# Altium schematic sheet 05_MCU1.SchDoc
size A4
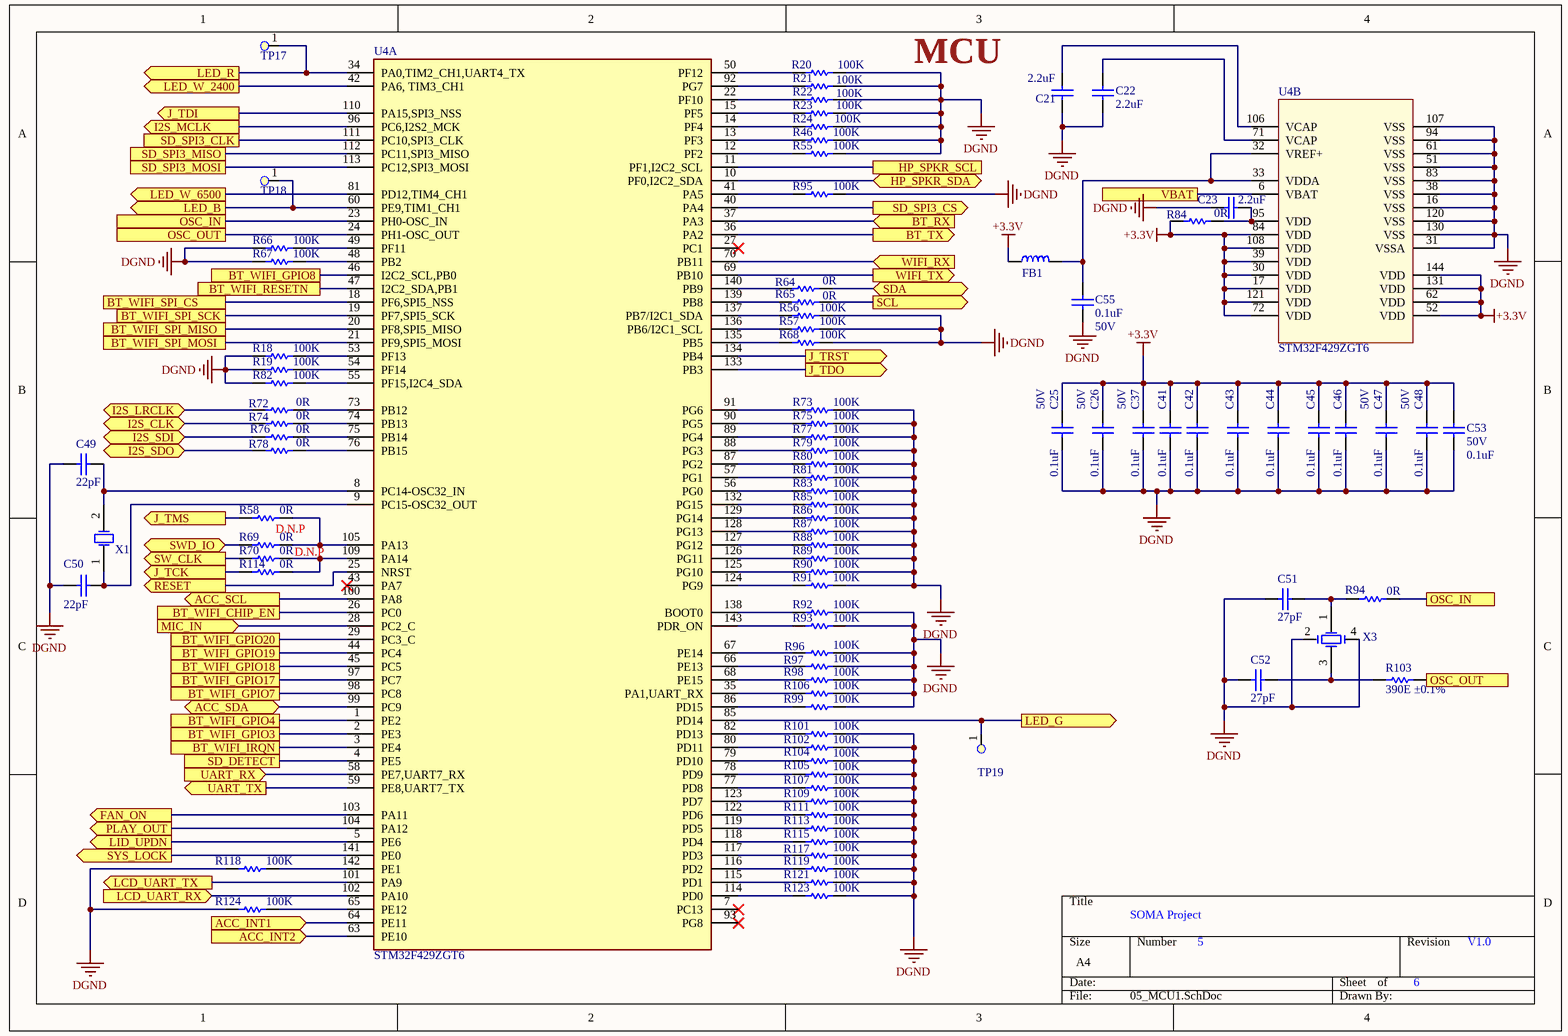
[diagram p0: 05_MCU1.SchDoc]

## Parts
C21  2.2uF  [C0402]
C22  2.2uF  [C0402]
C23  2.2uF  [C0402]
C25  Rating: 50V  [C0402]  (hidden comment: 0.1uF)
C26  Rating: 50V  [C0402]  (hidden comment: 0.1uF)
C37  Rating: 50V  [C0402]  (hidden comment: 0.1uF)
C41  0.1uF  [C0402]
C42  0.1uF  [C0402]
C43  0.1uF  [C0402]
C44  0.1uF  [C0402]
C45  0.1uF  [C0402]
C46  0.1uF  [C0402]
C47  Rating: 50V  [C0402]  (hidden comment: 0.1uF)
C48  Rating: 50V  [C0402]  (hidden comment: 0.1uF)
C49  22pF  [C0402]
C50  22pF  [C0402]
C51  27PF  [C0402]
C52  27PF  [C0402]
C53  Rating: 50V  [C0402]  (hidden comment: 0.1uF)
C55  Rating: 50V  [C0402]  (hidden comment: 0.1uF)
FB1  600 Ohms @ 100MHz  [FB0603]  (value not drawn)
R18  100K  [R0402]
R19  100K  [R0402]
R20  100K  [R0402]
R21  100K  [R0402]
R22  100K  [R0402]
R23  100K  [R0402]
R24  100K  [R0402]
R46  100K  [R0402]
R55  100K  [R0402]
R56  100K  [R0402]
R57  100K  [R0402]
R58  value 0R  [R0402]  (hidden comment: RES SMD 0 OHM JUMPER 1/16W 0402)
R64  value 0R  [R0402]  (hidden comment: RES SMD 0 OHM JUMPER 1/16W 0402)
R65  value 0R  [R0402]  (hidden comment: RES SMD 0 OHM JUMPER 1/16W 0402)
R66  100K  [R0402]
R67  100K  [R0402]
R68  100K  [R0402]
R69  value 0R  Assembly Option: D.N.P  [R0402]  (hidden comment: RES SMD 0 OHM JUMPER 1/16W 0402)
R70  value 0R  Assembly Option: D.N.P  [R0402]  (hidden comment: RES SMD 0 OHM JUMPER 1/16W 0402)
R72  value 0R  [R0402]  (hidden comment: RES SMD 0 OHM JUMPER 1/16W 0402)
R73  100K  [R0402]
R74  value 0R  [R0402]  (hidden comment: RES SMD 0 OHM JUMPER 1/16W 0402)
R75  100K  [R0402]
R76  value 0R  [R0402]  (hidden comment: RES SMD 0 OHM JUMPER 1/16W 0402)
R77  100K  [R0402]
R78  value 0R  [R0402]  (hidden comment: RES SMD 0 OHM JUMPER 1/16W 0402)
R79  100K  [R0402]
R80  100K  [R0402]
R81  100K  [R0402]
R82  100K  [R0402]
R83  100K  [R0402]
R84  value 0R  [R0402]  (hidden comment: RES SMD 0 OHM JUMPER 1/16W 0402)
R85  100K  [R0402]
R86  100K  [R0402]
R87  100K  [R0402]
R88  100K  [R0402]
R89  100K  [R0402]
R90  100K  [R0402]
R91  100K  [R0402]
R92  100K  [R0402]
R93  100K  [R0402]
R94  value 0R  [R0402]  (hidden comment: RES SMD 0 OHM JUMPER 1/16W 0402)
R95  100K  [R0402]
R96  100K  [R0402]
R97  100K  [R0402]
R98  100K  [R0402]
R99  100K  [R0402]
R101  100K  [R0402]
R102  100K  [R0402]
R103  value 390E ±0.1%  [R0603]  (hidden comment: RES SMD 390 OHM 0.1% 1/5W 0603)
R104  100K  [R0402]
R105  100K  [R0402]
R106  100K  [R0402]
R107  100K  [R0402]
R109  100K  [R0402]
R111  100K  [R0402]
R113  100K  [R0402]
R114  value 0R  [R0402]  (hidden comment: RES SMD 0 OHM JUMPER 1/16W 0402)
R115  100K  [R0402]
R117  100K  [R0402]
R118  100K  [R0402]
R119  100K  [R0402]
R121  100K  [R0402]
R123  100K  [R0402]
R124  100K  [R0402]
TP17  Test Point,1.6mm Diameter,SMD  [TP_63C]  (value not drawn)  (no BOM)
TP18  Test Point,1.6mm Diameter,SMD  [TP_63C]  (value not drawn)  (no BOM)
TP19  Test Point,1.6mm Diameter,SMD  [TP_63C]  (value not drawn)  (no BOM)
U4  STM32F429ZGT6  [QFP50P2200X2200X160-144N]  (parts A,B of 2)
X1  32.7680KHZ  [XTAL320X150X90-2N]  (value not drawn)
X3  8MHz  [XTAL600X360X120-4N]  (value not drawn)

## Ports
ACC_INT1 (in), ACC_INT2 (in), ACC_SCL (out), ACC_SDA (bidir), BT_RX (in), BT_TX (out), BT_WIFI_CHIP_EN, BT_WIFI_GPIO3, BT_WIFI_GPIO4, BT_WIFI_GPIO7, BT_WIFI_GPIO8, BT_WIFI_GPIO17, BT_WIFI_GPIO18, BT_WIFI_GPIO19, BT_WIFI_GPIO20, BT_WIFI_IRQN, BT_WIFI_RESETN, BT_WIFI_SPI_CS, BT_WIFI_SPI_MISO, BT_WIFI_SPI_MOSI, BT_WIFI_SPI_SCK, FAN_ON (out), HP_SPKR_SCL, HP_SPKR_SDA (bidir), I2S_CLK (bidir), I2S_LRCLK (bidir), I2S_MCLK (out), I2S_SDI (bidir), I2S_SDO (bidir), J_TCK (out), J_TDI (out), J_TDO (out), J_TMS (out), J_TRST (out), LCD_UART_RX (in), LCD_UART_TX (out), LED_B (out), LED_G (out), LED_R (out), LED_W_2400 (out), LED_W_6500 (out), LID_UPDN (out), MIC_IN (in), OSC_IN, OSC_OUT, PLAY_OUT (out), RESET (out), SCL (out), SD_DETECT, SD_SPI3_CLK, SD_SPI3_CS (out), SD_SPI3_MISO, SD_SPI3_MOSI, SDA (bidir), SW_CLK (out), SWD_IO (bidir), SYS_LOCK (out), UART_RX (in), UART_TX (out), VBAT, WIFI_RX (in), WIFI_TX (out)

## Nets
+3.3V: C25.2 C26.2 C37.2 C41.2 C42.2 C43.2 C44.2 C45.2 C46.2 C47.2 C48.2 C53.2 FB1.2 R84.1 U4.17(VDD) U4.30(VDD) U4.39(VDD) U4.52(VDD) U4.62(VDD) U4.72(VDD) U4.84(VDD) U4.108(VDD) U4.121(VDD) U4.131(VDD) U4.144(VDD)
DGND: C21.2 C22.2 C23.1 C25.1 C26.1 C37.1 C41.1 C42.1 C43.1 C44.1 C45.1 C46.1 C47.1 C48.1 C49.1 C50.1 C51.1 C52.1 C53.1 C55.1 R18.1 R19.1 R20.2 R21.2 R22.2 R23.2 R24.2 R46.2 R55.2 R56.2 R57.2 R66.1 R67.1 R68.2 R73.2 R75.2 R77.2 R79.2 R80.2 R81.2 R82.1 R83.2 R85.2 R86.2 R87.2 R88.2 R89.2 R90.2 R91.2 R92.2 R93.2 R95.2 R96.2 R97.2 R98.2 R99.2 R101.2 R102.2 R104.2 R105.2 R106.2 R107.2 R109.2 R111.2 R113.2 R115.2 R117.2 R118.1 R119.2 R121.2 R123.2 R124.1 U4.16(VSS) U4.31(VSSA) U4.38(VSS) U4.51(VSS) U4.61(VSS) U4.83(VSS) U4.94(VSS) U4.107(VSS) U4.120(VSS) U4.130(VSS) X3.2 X3.4
ACC_INT1: U4.64(PE11) ; port ACC_INT1
ACC_INT2: U4.63(PE10) ; port ACC_INT2
ACC_SCL: U4.100(PA8) ; port ACC_SCL
ACC_SDA: U4.99(PC9) ; port ACC_SDA
BT_RX: U4.37(PA3) ; port BT_RX
BT_TX: U4.36(PA2) ; port BT_TX
BT_WIFI_CHIP_EN: U4.26(PC0) ; port BT_WIFI_CHIP_EN
BT_WIFI_GPIO3: U4.2(PE3) ; port BT_WIFI_GPIO3
BT_WIFI_GPIO4: U4.1(PE2) ; port BT_WIFI_GPIO4
BT_WIFI_GPIO7: U4.98(PC8) ; port BT_WIFI_GPIO7
BT_WIFI_GPIO8: U4.46(I2C2_SCL,PB0) ; port BT_WIFI_GPIO8
BT_WIFI_GPIO17: U4.97(PC7) ; port BT_WIFI_GPIO17
BT_WIFI_GPIO18: U4.45(PC5) ; port BT_WIFI_GPIO18
BT_WIFI_GPIO19: U4.44(PC4) ; port BT_WIFI_GPIO19
BT_WIFI_GPIO20: U4.29(PC3_C) ; port BT_WIFI_GPIO20
BT_WIFI_IRQN: U4.3(PE4) ; port BT_WIFI_IRQN
BT_WIFI_RESETN: U4.47(I2C2_SDA,PB1) ; port BT_WIFI_RESETN
BT_WIFI_SPI_CS: U4.18(PF6,SPI5_NSS) ; port BT_WIFI_SPI_CS
BT_WIFI_SPI_MISO: U4.20(PF8,SPI5_MISO) ; port BT_WIFI_SPI_MISO
BT_WIFI_SPI_MOSI: U4.21(PF9,SPI5_MOSI) ; port BT_WIFI_SPI_MOSI
BT_WIFI_SPI_SCK: U4.19(PF7,SPI5_SCK) ; port BT_WIFI_SPI_SCK
FAN_ON: U4.103(PA11) ; port FAN_ON
HP_SPKR_SCL: U4.11(PF1,I2C2_SCL) ; port HP_SPKR_SCL
HP_SPKR_SDA: U4.10(PF0,I2C2_SDA) ; port HP_SPKR_SDA
I2S_CLK: R74.1 ; port I2S_CLK
I2S_LRCLK: R72.1 ; port I2S_LRCLK
I2S_MCLK: U4.96(PC6,I2S2_MCK) ; port I2S_MCLK
I2S_SDI: R76.2 ; port I2S_SDI
I2S_SDO: R78.1 ; port I2S_SDO
J_TCK: R114.1 ; port J_TCK
J_TDI: U4.110(PA15,SPI3_NSS) ; port J_TDI
J_TDO: U4.133(PB3) ; port J_TDO
J_TMS: R58.1 ; port J_TMS
J_TRST: U4.134(PB4) ; port J_TRST
LCD_UART_RX: U4.102(PA10) ; port LCD_UART_RX
LCD_UART_TX: U4.101(PA9) ; port LCD_UART_TX
LED_B: TP18.1 U4.60(PE9,TIM1_CH1) ; port LED_B
LED_G: TP19.1 U4.85(PD14) ; port LED_G
LED_R: TP17.1 U4.34(PA0,TIM2_CH1,UART4_TX) ; port LED_R
LED_W_2400: U4.42(PA6,_TIM3_CH1) ; port LED_W_2400
LED_W_6500: U4.81(PD12,TIM4_CH1) ; port LED_W_6500
LID_UPDN: U4.5(PE6) ; port LID_UPDN
MIC_IN: U4.28(PC2_C) ; port MIC_IN
OSC_IN: R94.2 U4.23(PH0-OSC_IN) ; port OSC_IN
OSC_OUT: R103.2 U4.24(PH1-OSC_OUT) ; port OSC_OUT
PLAY_OUT: U4.104(PA12) ; port PLAY_OUT
RESET: U4.25(NRST) ; port RESET
SCL: R65.2 ; port SCL
SD_DETECT: U4.4(PE5) ; port SD_DETECT
SD_SPI3_CLK: U4.111(PC10,SPI3_CLK) ; port SD_SPI3_CLK
SD_SPI3_CS: U4.40(PA4) ; port SD_SPI3_CS
SD_SPI3_MISO: U4.112(PC11,SPI3_MISO) ; port SD_SPI3_MISO
SD_SPI3_MOSI: U4.113(PC12,SPI3_MOSI) ; port SD_SPI3_MOSI
SDA: R64.2 ; port SDA
SW_CLK: R70.1 ; port SW_CLK
SWD_IO: R69.1 ; port SWD_IO
SYS_LOCK: U4.141(PE0) ; port SYS_LOCK
UART_RX: U4.58(PE7,UART7_RX) ; port UART_RX
UART_TX: U4.59(PE8,UART7_TX) ; port UART_TX
VBAT: U4.6(VBAT) ; port VBAT
WIFI_RX: U4.70(PB11) ; port WIFI_RX
WIFI_TX: U4.69(PB10) ; port WIFI_TX
NetC21_1: C21.1 U4.106(VCAP)
NetC22_1: C22.1 U4.71(VCAP)
NetC23_2: C23.2 R84.2 U4.95(VDD)
NetC49_2: C49.2 U4.8(PC14-OSC32_IN) X1.2(OSC2)
NetC50_2: C50.2 U4.9(PC15-OSC32_OUT) X1.1(OSC1)
NetC51_2: C51.2 R94.1 X3.1(OSC1)
NetC52_2: C52.2 R103.1 X3.3(OSC2)
NetC55_2: C55.2 FB1.1 U4.32(VREF+) U4.33(VDDA)
NetR18_2: R18.2 U4.53(PF13)
NetR19_2: R19.2 U4.54(PF14)
NetR20_1: R20.1 U4.50(PF12)
NetR21_1: R21.1 U4.92(PG7)
NetR22_1: R22.1 U4.22(PF10)
NetR23_1: R23.1 U4.15(PF5)
NetR24_1: R24.1 U4.14(PF4)
NetR46_1: R46.1 U4.13(PF3)
NetR55_1: R55.1 U4.12(PF2)
NetR56_1: R56.1 U4.137(PB7/I2C1_SDA)
NetR57_1: R57.1 U4.136(PB6/I2C1_SCL)
NetR58_2: R58.2 R69.2 U4.105(PA13)
NetR64_1: R64.1 U4.140(PB9)
NetR65_1: R65.1 U4.139(PB8)
NetR66_2: R66.2 U4.49(PF11)
NetR67_2: R67.2 U4.48(PB2)
NetR68_1: R68.1 U4.135(PB5)
NetR70_2: R70.2 R114.2 U4.109(PA14)
NetR72_2: R72.2 U4.73(PB12)
NetR73_1: R73.1 U4.91(PG6)
NetR74_2: R74.2 U4.74(PB13)
NetR75_1: R75.1 U4.90(PG5)
NetR76_1: R76.1 U4.75(PB14)
NetR77_1: R77.1 U4.89(PG4)
NetR78_2: R78.2 U4.76(PB15)
NetR79_1: R79.1 U4.88(PG3)
NetR80_1: R80.1 U4.87(PG2)
NetR81_1: R81.1 U4.57(PG1)
NetR82_2: R82.2 U4.55(PF15,I2C4_SDA)
NetR83_1: R83.1 U4.56(PG0)
NetR85_1: R85.1 U4.132(PG15)
NetR86_1: R86.1 U4.129(PG14)
NetR87_1: R87.1 U4.128(PG13)
NetR88_1: R88.1 U4.127(PG12)
NetR89_1: R89.1 U4.126(PG11)
NetR90_1: R90.1 U4.125(PG10)
NetR91_1: R91.1 U4.124(PG9)
NetR92_1: R92.1 U4.138(BOOT0)
NetR93_1: R93.1 U4.143(PDR_ON)
NetR95_1: R95.1 U4.41(PA5)
NetR96_1: R96.1 U4.67(PE14)
NetR97_1: R97.1 U4.66(PE13)
NetR98_1: R98.1 U4.68(PE15)
NetR99_1: R99.1 U4.86(PD15)
NetR101_1: R101.1 U4.82(PD13)
NetR102_1: R102.1 U4.80(PD11)
NetR104_1: R104.1 U4.79(PD10)
NetR105_1: R105.1 U4.78(PD9)
NetR106_1: R106.1 U4.35(PA1,UART_RX)
NetR107_1: R107.1 U4.77(PD8)
NetR109_1: R109.1 U4.123(PD7)
NetR111_1: R111.1 U4.122(PD6)
NetR113_1: R113.1 U4.119(PD5)
NetR115_1: R115.1 U4.118(PD4)
NetR117_1: R117.1 U4.117(PD3)
NetR118_2: R118.2 U4.142(PE1)
NetR119_1: R119.1 U4.116(PD2)
NetR121_1: R121.1 U4.115(PD1)
NetR123_1: R123.1 U4.114(PD0)
NetR124_2: R124.2 U4.65(PE12)

Not connected (* = marked no-connect by the designer): U4 7(PC13)* 27(PC1)* 43(PA7)* 93(PG8)*

## Notes on the sheet
- MCU
- SOMA Project
- 5
- 6
- V1.0

## Library data of the parts
C21-C23 = CAP CER 2.2UF 25V X5R 0402: 2.2 µF ±10% 25V Ceramic Capacitor X5R 0402 (1005 Metric); Manufacturer: TDK Corporation; Manufacturer part Number: C1005X5R1E225K050BE; Type: CAP; Value: 2.2uF; Tolerance: ±10%; Operating Temperature: -55°C ~ 85°C; Package: 0402 (1005 Metric); Distributor: Digikey; Reference link: https://www.digikey.com/en/products/detail/tdk-corporation/C1005X5R1E225K050BE/7907740; Distributor part Number: 445-175216-1-ND; Unit Price: $0.38000; Rating: 25V
C25 C26 C37 C41-C48 C53 C55 = CAP CER 0.1UF 50V X7R 0402: Manufacturer: AVX; Manufacturer part Number: 04025C104KAT2A; Tolerance: ±10%; Distributor: Mouser; Package: 0402; Type: CAP; Operating Temperature: -55°C ~ 125°C; Distributor part Number: 581-04025C104KAT2A; Reference link: https://www.mouser.in/ProductDetail/AVX/04025C104KAT2A?qs=%2Fha2pyFaduhvAwOoQhW9hDDlPxePcbvdgYQJEdBTMGpxgpoTOSNvPA%3D%3D; Value: 0.1uF; Unit Price: ₹7.47
  C41-C46: Rating: 50V
C49 C50 = CAP CER 22PF 50V C0G/NP0 0402: Manufacturer: AVX Corporation; Manufacturer part Number: 04025A220JAT2A; Tolerance: ±5%; Assembly Option: DNP; Operating Temperature: -55°C ~ 125°C; Reference link: https://www.digikey.com/product-detail/en/avx-corporation/04025A220JAT2A/478-1074-1-ND/564106; Package: 0402; Distributor: Digikey; Distributor part Number: 478-1074-1-ND; Type: CAP; Value: 22pF; Rating: 50V; Unit Price: $0.10000
C51 C52 = CAP CER 27PF 50V C0G/NPO 0402: 27pF ±5% 50V Ceramic Capacitor C0G, NP0 0402 (1005 Metric); Manufacturer: Yageo; Manufacturer part Number: CC0402JRNPO9BN270; Type: CAP; Assembly Option: DNP; Distributor: Digikey; Distributor part Number: 311-1019-1-ND; Package: 0402; Operating Temperature: -55°C ~ 125°C; Tolerance: ±5%; Reference link: https://www.digikey.in/product-detail/en/yageo/CC0402JRNPO9BN270/311-1019-1-ND/302936; Value: 27pF; Rating: 50V; Unit Price: 0.00651
FB1 = FERRITE BEAD 600 OHM 0603 1LN: Manufacturer: Murata; Manufacturer part Number: BLM18AG601SN1D; Type: FB; Assembly Option: DNP; Value: 600 Ohms @ 100MHz; Distributor: Digikey; Package: 0603; Operating Temperature: -55°C ~ 125°C; Rating: 600 Ohms @ 100MHz; Distributor part Number: 490-1014-2-ND; Reference link: https://www.digikey.com/product-detail/en/murata-electronics-north-america/BLM18AG601SN1D/490-1014-2-ND/584225; Unit Price: $0.02306
R18-R24 R46 R55-R57 R66-R68 R73 R75 R77 R79-R83 R85-R93 R95-R99 R101 R102 R104-R107 R109 R111 R113 R115 R117-R119 R121 R123 R124 = RES SMD 100K OHM 1% 1/10W 0402: 100 kOhms ±1% 0.1W, 1/10W Chip Resistor 0402 (1005 Metric) Automotive AEC-Q200 Thick Film; Manufacturer: Panasonic Electronic Components; Manufacturer part Number: ERJ-2RKF1003X; Operating Temperature: -55°C ~ 155°C; Package: 0402; Distributor: Digikey; Type: RES; Reference link: https://www.digikey.in/product-detail/en/panasonic-electronic-components/ERJ-2RKF1003X/P100KLCT-ND/194127; Distributor part Number: P100KLCT-ND; Unit Price: 7.46000; Tolerance: ±1%; Rating: 1/10W; Value: 100K
R58 R64 R65 R69 R70 R72 R74 R76 R78 R84 R94 R114 = RES SMD 0 OHM JUMPER 1/16W 0402: 0 Ohms Jumper 0.063W, 1/16W Chip Resistor 0402 (1005 Metric) Moisture Resistant Thick Film; Manufacturer: Yageo; Manufacturer part Number: RC0402JR-070RP; Distributor: Digikey; Distributor part Number: YAG1279TR-ND; Unit Price: 0.00377; Reference link: https://www.digikey.sg/product-detail/en/yageo/RC0402JR-070RP/YAG1279TR-ND/4935294; Type: RES; Rating: 0.063W, 1/16W; Package: 0402 (1005 Metric); Tolerance: Jumper; Part Status: Active; Operating Temperature: -55°C ~ 155°C; Size / Dimension: 0.039" L x 0.020" W (1.00mm x 0.50mm)
R103 = RES SMD 390 OHM 0.1% 1/5W 0603: Manufacturer: Panasonic; Manufacturer part Number: ERJ-PB3B3900V; Rating: 0.2W; Assembly Option: DNP; Distributor: Digikey; Package: 0603; Operating Temperature: -55°C ~ 155°C; Type: RES; Distributor part Number: P19924TR-ND; Reference link: https://www.digikey.in/product-detail/en/panasonic-electronic-components/ERJ-PB3B3900V/P19924TR-ND/6212707; Tolerance: ±0.1%; Unit Price: 0.02610
U4 = STM32F429ZGT6: ARM® Cortex®-M4 series Microcontroller IC 32-Bit Single-Core 180MHz 1MB (1M x 8) FLASH 144-LQFP (20x20); Manufacturer: STMicroelectronics; Categories: Embedded - Microcontrollers; Rating: 1.8V ~ 3.6V; Manufacturer Part Number: STM32F429ZGT6; Part Status: Active; Operating Temperature: *-40°C ~ 85°C (TA); Mounting Type: Surface Mount; Package / Case: 144-LQFP; Distributor: Digikey; Distributor Part Number: 497-17461-ND; Reference Link: https://www.digikey.com/en/products/detail/stmicroelectronics/STM32F429ZGT6/4357426; Unit Price: 21.55
X1 = CRYSTAL 32.7680KHZ 12.5PF SMD: Manufacturer: NDK America, Inc.; Manufacturer part Number: NX3215SA-32.768K-STD-MUA-8; Rating: 70 kOhms; Value: 32.768 kHz; Tolerance: ±20ppm; Distributor: Digikey; Package: 2-SMD, No Lead; Operating Temperature: -40°C ~ 85°C; Type: kHz Crystal (Tuning Fork); Distributor part Number: 644-1156-1-ND; Reference link: https://www.digikey.com/en/products/detail/ndk-america-inc/NX3215SA-32-768K-STD-MUA-8/2261469; Unit Price: $0.79000
X3 = CRYSTAL 8.0000MHZ 18PF SMD: Manufacturer: Abracon LLC; Manufacturer part Number: ABMM2-8.000MHZ-D1-T; Rating: 72 Ohms; Assembly Option: DNP; Tolerance: ±20ppm; Distributor: Digikey; Package: HC-49/US; Operating Temperature: -40°C ~ 85°C; Type: Crystal; Distributor part Number: 535-13477-2-ND; Reference link: https://www.digikey.com/product-detail/en/abracon-llc/ABMM2-8.000MHZ-D1-T/535-13477-2-ND/5980073; Value: 8MHz
TP17-TP19 = Test Point,1.6mm Diameter,SMD: AEMCI Part Number: *; Vendor: *; Vendor ID: *